# Altium schematic sheet AMS_supply.SchDoc: Supply Circuit
size A4; CheckedBy: Àlex Sánchez i Benet; DrawnBy: Àlex Sánchez i Benet; DocumentNumber: 1; Revision: 1; SheetNumber: 2; SheetTotal: 5; University: UPC EEBE; City: Barcelona; Country: Spain; CP: 08019; Address: Av. Eduard Maristany, 16
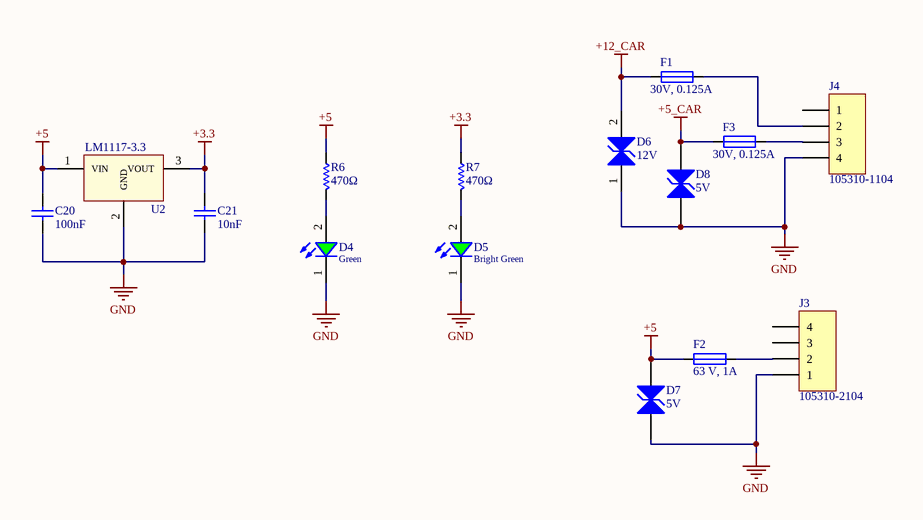
[diagram p0: AMS_supply.SchDoc]

## Parts
C20  100nF  [0805_2x1.25x0.8mm_Reflow Soldering]
C21  10nF  [0805_2x1.25x0.8mm_Reflow Soldering]
D4  Green  [WL-SMCW_0805]
D5  Bright Green  [WL-SMCW_0805]
D6  12V  [WE-TVSP_DO-214AC_Bidirectional]
D7  5V  [WE-TVSP_DO-214AC_Bidirectional]
D8  5V  [WE-TVSP_DO-214AC_Bidirectional]
F1  30V, 0.125A  [1206L012]
F2  63 V, 1A  [437 Series]
F3  30V, 0.125A  [1206L012]
J3  105310-2104  [105310-2104]
J4  105310-1104  [105310-1104]
R6  470Ω  [CR0805]
R7  470Ω  [CR0805]
U2  Reference: LM1117-3.3  [LM1117IMP3.3]  (hidden comment: 1.5 - 13.8 Vin, 3.3 Vout)

## Nets
+3.3: C21.2 R7.2 U2.3(VOUT)
+5: C20.2 D7.2(C) F2.1 R6.2 U2.1(VIN)
+5_CAR: D8.2(C) F3.1
+12_CAR: D6.2(C) F1.1
GND: C20.1 C21.1 D4.1(K) D5.1(K) D6.1(C) D7.1(C) D8.1(C) J3.1 J4.4 U2.2(GND)
NetD4_2: D4.2(A) R6.1
NetD5_2: D5.2(A) R7.1
NetF1_2: F1.2 J4.2
NetF2_2: F2.2 J3.2
NetF3_2: F3.2 J4.3

Not connected (* = marked no-connect by the designer): J3 3 4; J4 1

## Notes on the sheet
- Title
- e-Tech Racing
- UPC EEBE
- Size:
- Date:
- Drawn by:
- A4
- Number:
- Time:
- Revision:
- Sheet
- of
- Av. Eduard Maristany, 16
- 08019
- Barcelona Spain
- Made with:
- Checked by:

## Library data of the parts
C20 = 885012207098: WCAP-CSGP Ceramic Capacitors, 0805, X7R, 50V, 100nF; Rated Voltage: 50V DC; ComponentLink1Description: Manufacturer; ComponentLink1URL: http://www.we-online.de; ComponentLink2Description: Datasheet; ComponentLink2URL: http://katalog.we-online.de/pbs/datasheet/885012207098.pdf; Part Number: 885012207098; Publisher: Wurth Elektronik; Size: 0805; Operating Temperature: -55 °C to +125 °C; Value: 100nF; Ceramic Type: X7R
C21 = 885012207092: WCAP-CSGP Ceramic Capacitors, 0805, X7R, 50V, 10nF; Rated Voltage: 50V DC; ComponentLink1Description: Manufacturer; ComponentLink1URL: http://www.we-online.de; ComponentLink2Description: Datasheet; ComponentLink2URL: http://katalog.we-online.de/pbs/datasheet/885012207092.pdf; Part Number: 885012207092; Publisher: Wurth Elektronik; Size: 0805; Operating Temperature: -55 °C to +125 °C; Value: 10nF; Ceramic Type: X7R
D4 = 150080GS75000: SMT Mono-color Chip LED Waterclear WL-SMCW, size 0805, Green, 3.2 V, 140 deg, 450 mcd; Forward Voltage: 3.2 V; Viewing Angle: 140 deg; Peak Wavelength: 515 nm; Dominant Wavelength: 525 nm; Luminous Intensity: 450 mcd; Chip Technology: InGaN; ComponentLink1Description: Manufacturer; ComponentLink1URL: http://www.we-online.de; ComponentLink2Description: Datasheet; ComponentLink2URL: https://katalog.we-online.de/led/datasheet/150080GS75000.pdf; Part Number: 150080GS75000; Published Date: November 2018; Publisher: Wurth Elektronik; Size: 0805; Operating Temperature: -40 to 85 degC; Emitting Color: Green; Mounting Technology: SMT; Packaging: Tape and Reel
D5 = 150080VS75000: SMT Mono-color Chip LED Waterclear WL-SMCW, size 0805, Bright Green, 2 V, 140 deg, 40 mcd; Forward Voltage: 2 V; Viewing Angle: 140 deg; Peak Wavelength: 572 nm; Dominant Wavelength: 570 nm; Luminous Intensity: 40 mcd; Chip Technology: AlInGaP; ComponentLink1Description: Manufacturer; ComponentLink1URL: http://www.we-online.de; ComponentLink2Description: Datasheet; ComponentLink2URL: https://katalog.we-online.de/led/datasheet/150080VS75000.pdf; Part Number: 150080VS75000; Published Date: November 2018; Publisher: Wurth Elektronik; Size: 0805; Operating Temperature: -40 to 85 degC; Emitting Color: Bright Green; Mounting Technology: SMT; Packaging: Tape and Reel
D6 = 824501121: WE-TVSP Power TVS Diode, size DO-214AC, Bidirectional, 400 W, 12 VDC; Peak Pulse Current: 20.1 A; Power Dissipation: 400 W; Reverse Breakdown Voltage: 14 V; Surge Clamping Voltage: 19.9 V; ComponentLink1Description: Manufacturer; ComponentLink1URL: http://www.we-online.de; ComponentLink2Description: Datasheet; ComponentLink2URL: https://katalog.we-online.de/pbs/datasheet/824501121.pdf; Part Number: 824501121; Publisher: Wurth Elektronik; Size: DO-214AC; Operating Temperature: -65 to 150 degC; Mounting Technology: SMT; Packaging: Tape and Reel; Polarity: Bidirectional; Reverse Stand-Off Voltage: 12 V
D7 D8 = 824501500: WE-TVSP Power TVS Diode, size DO-214AC, Bidirectional, 400 W, 5 VDC; Manufacturer: Wurth Elektronik; Peak Pulse Current: 43.5 A; Power Dissipation: 400 W; Reverse Breakdown Voltage: 6.7 V; Surge Clamping Voltage: 9.2 V; ComponentLink1Description: Manufacturer; ComponentLink1URL: http://www.we-online.de; ComponentLink2Description: Datasheet; ComponentLink2URL: https://katalog.we-online.de/pbs/datasheet/824501500.pdf; Part Number: 824501500; Size: DO-214AC; Operating Temperature: -65ºC to 150 ºC; Mounting Technology: SMT; Packaging: Tape and Reel; Polarity: Bidirectional; Reverse Stand-Off Voltage: 5 V
F1 F3 = 1206L012: 1206L Series; Manufacturer: Littlefuse; ComponentLink1Description: Datasheet; ComponentLink1URL: https://www.littelfuse.com/~/media/electronics/datasheets/resettable_ptcs/littelfuse_ptc_1206l_datasheet.pdf.pdf
F2 = 0437001A: 437A Series Fuse; Manufacturer: Littlefuse; ComponentLink1Description: Datasheet; ComponentLink1URL: https://www.littelfuse.com/~/media/electronics/datasheets/fuses/littelfuse_fuse_437a_datasheet.pdf.pdf
J3 = 105310-2104: Nano-Fit Vertical Header, Through Hole, 2.50mm Pitch, Dual Row, 4 Circuits, Natural; Manufacturer: Molex; Rated Voltage: 250V DC; Rated Current: 6.5A; Operating Temperature: -40° to +105°C; ComponentLink1Description: Datasheet; ComponentLink1URL: https://www.molex.com/webdocs/datasheets/pdf/en-us/1053102104_PCB_HEADERS.pdf
J4 = 105310-1104: Nano-Fit Vertical Header, Through Hole, 2.50mm Pitch, Dual Row, 4 Circuits, Black; Manufacturer: Molex; Rated Voltage: 250V DC; Rated Current: 6.5A; Operating Temperature: -40° to +105°C; ComponentLink2Description: Datasheet; ComponentLink2URL: https://www.molex.com/webdocs/datasheets/pdf/en-us/1053101104_PCB_HEADERS.pdf
R6 R7 = CR0805-FX-4700GLF: Chip Resistor 0805; Manufacturer: Bourns; ComponentLink1Description: Datasheet; ComponentLink1URL: https://www.bourns.com/docs/product-datasheets/chpreztr.pdf?sfvrsn=566c91f1_11
U2 = LM1117IMP-3.3/NOPB: 800-mA Low-Dropout Linear Regulator; Manufacturer: Texas Instruments; Output Voltage: 3.3 V; Output Current: 800 mA; Input Voltage: 1.5-13.8 V; ComponentLink1Description: Datasheet; ComponentLink1URL: http://www.ti.com/lit/ds/symlink/lm1117.pdf